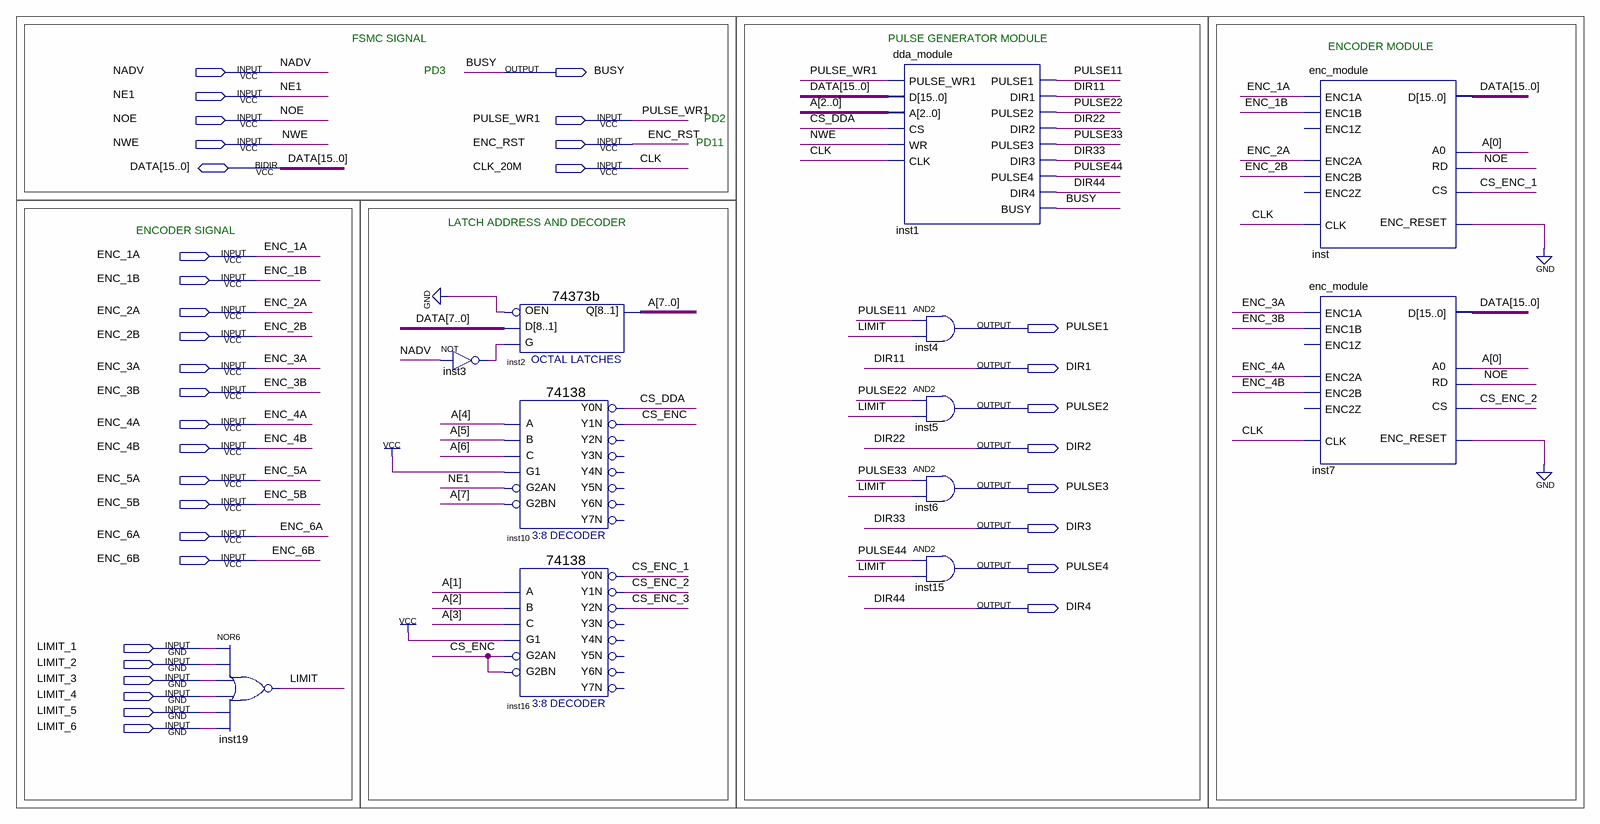
[diagram p0: schematic sheet]
// Quartus schematic read_encoder.bdf as structural Verilog: 12 symbols, 35 pins
module read_encoder (
  input  NADV,
  input  NE1,
  input  NOE,
  input  PULSE_WR1,
  input  NWE,
  input  ENC_RST,
  input  CLK_20M,
  input  ENC_1A,
  input  ENC_1B,
  input  ENC_2A,
  input  ENC_2B,
  input  ENC_3A,
  input  ENC_3B,
  input  ENC_4A,
  input  ENC_4B,
  input  ENC_5A,
  input  ENC_5B,
  input  ENC_6A,
  input  ENC_6B,
  input  LIMIT_1,
  input  LIMIT_2,
  input  LIMIT_3,
  input  LIMIT_4,
  input  LIMIT_5,
  input  LIMIT_6,
  inout  [15:0] DATA,
  output BUSY,
  output PULSE1,
  output DIR1,
  output PULSE2,
  output DIR2,
  output PULSE3,
  output DIR3,
  output PULSE4,
  output DIR4
);

  wire CS_DDA, CS_ENC, CS_ENC_1, CS_ENC_2, CS_ENC_3, inst3_out, LIMIT, PULSE11, PULSE22, PULSE33, PULSE44;
  wire [7:0] A;

  nor inst19 (LIMIT, LIMIT_1, LIMIT_2, LIMIT_3, LIMIT_4, LIMIT_5, LIMIT_6);
  not inst3 (inst3_out, NADV);
  \74373b  inst2 (.D(DATA[7:0]), .G(inst3_out), .OEN(1'b0), .Q(A));
  \74138  inst10 (
    .A(A[4]), .B(A[5]), .G1(1'b1), .C(A[6]), .G2AN(NE1), .G2BN(A[7]), .Y0N(CS_DDA), .Y1N(CS_ENC));  // open: Y2N, Y3N, Y4N, Y5N, Y6N, Y7N
  \74138  inst16 (
    .A(A[1]), .B(A[2]), .G1(1'b1), .C(A[3]), .G2AN(CS_ENC), .G2BN(CS_ENC), .Y0N(CS_ENC_1), .Y1N(CS_ENC_2),
    .Y2N(CS_ENC_3));  // open: Y3N, Y4N, Y5N, Y6N, Y7N
  dda_module inst1 (
    .PULSE_WR1(PULSE_WR1), .D(DATA), .A(A[2:0]), .CS(CS_DDA), .WR(NWE), .CLK(CLK_20M), .PULSE1(PULSE11),
    .DIR1(DIR1), .PULSE2(PULSE22), .DIR2(DIR2), .PULSE3(PULSE33), .DIR3(DIR3), .PULSE4(PULSE44), .DIR4(DIR4),
    .BUSY(BUSY));
  and inst4 (PULSE1, PULSE11, LIMIT);
  and inst5 (PULSE2, PULSE22, LIMIT);
  and inst6 (PULSE3, PULSE33, LIMIT);
  and inst15 (PULSE4, PULSE44, LIMIT);
  enc_module inst (
    .ENC_RESET(1'b0), .ENC1A(ENC_1A), .ENC1B(ENC_1B), .ENC2A(ENC_2A), .ENC2B(ENC_2B), .CLK(CLK_20M),
    .A0(A[0]), .CS(CS_ENC_1), .RD(NOE), .D(DATA));  // open: ENC1Z, ENC2Z
  enc_module inst7 (
    .ENC_RESET(1'b0), .ENC1A(ENC_3A), .ENC1B(ENC_3B), .ENC2A(ENC_4A), .ENC2B(ENC_4B), .CLK(CLK_20M),
    .A0(A[0]), .CS(CS_ENC_2), .RD(NOE), .D(DATA));  // open: ENC1Z, ENC2Z

  // Other names for the same wires on the sheet: CLK = CLK_20M; DIR11 = DIR1; DIR22 = DIR2; DIR33 = DIR3;
  //   DIR44 = DIR4

  // Notes on the sheet:
  //   FSMC SIGNAL
  //   PULSE GENERATOR MODULE
  //   ENCODER MODULE
  //   PD3
  //   PD2
  //   PD11
  //   LATCH ADDRESS AND DECODER
  //   ENCODER SIGNAL
endmodule
